# Altium schematic sheet Схема принципиальная.SchDoc
size 209 x 297 mm; Наименование организации: SmartThings; Наименование изделия 1: SmartHeat Electric; Наименование изделия 2: Схема электрическая; Наименование изделия 3: принципиальная
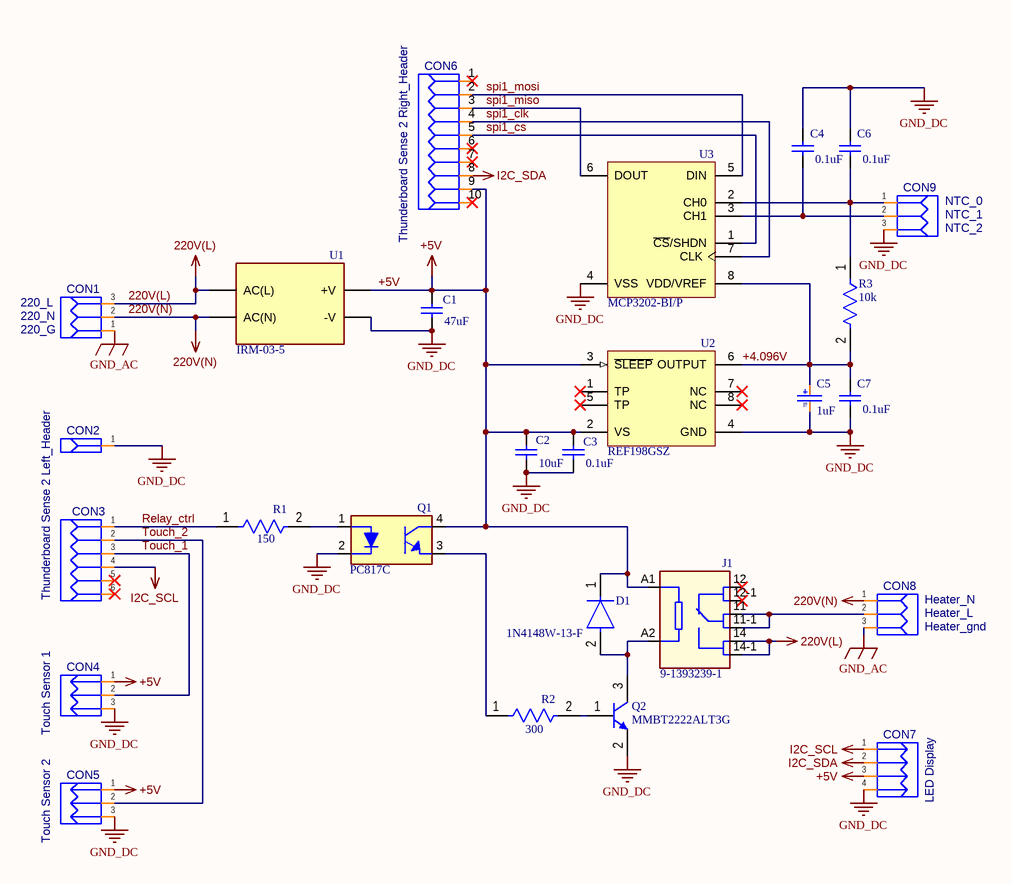
[diagram p0: Схема принципиальная.SchDoc]

## Parts
C1  47uF  [MURA-1210_H_2.7_L]
C2  10uF  [CAPC2013X135X45ML10T25]
C3  0.1uF  [CAPC2013X140X45NL15T25]
C4  0.1uF  [CAPC2013X140X45NL15T25]
C5  1uF  [TANTAL_B]
C6  0.1uF  [CAPC2013X140X45NL15T25]
C7  0.1uF  [CAPC2013X140X45NL15T25]
CON1  DG128-3  [DG129-5.08-3]  (value not drawn)
CON2  PBS-01  [PBS-01]  (value not drawn)
CON3  PBS-06  [PBS-06]  (value not drawn)
CON4  PLS-03  [PLS-03]  (value not drawn)
CON5  PLS-03  [PLS-03]  (value not drawn)
CON6  PBS-10  [PBS-10]  (value not drawn)
CON7  PLS-04  [PLS-04]  (value not drawn)
CON8  DG128-3  [DG129-5.08-3]  (value not drawn)
CON9  DG128-3  [DG129-5.08-3]  (value not drawn)
D1  1N4148W-13-F  [FP-SOD123-MFG]
J1  9-1393239-1  [RELAY_9-1393239-1]
Q1  PC817C  [DIP762W50P254L650H458Q4B]
Q2  MMBT2222ALT3G  [ONSC-SOT-23-3-318-08_V]
R1  150  [FP-CR0805-IPC_C]
R2  300  [FP-CR0805-IPC_C]
R3  10k  [FP-CRCW1206-e3-IPC_C]
U1  IRM-03-5  [footprint_IRM-03-5]
U2  REF198GSZ  [ADI-R-8_M]
U3  MCP3202-BI/P  [PDIP300-P8]

## Nets
220V(L): CON1.3 J1.14 J1.14-1 U1.AC/L(AC(L))
220V(N): CON1.2 CON8.1 U1.AC/N(AC(N))
+5V: C1.2 C2.2 C3.2 CON4.1 CON5.1 CON6.9 CON7.3 D1.1(C) J1.A1 Q1.4 U1.+V U2.2(VS) U2.3(~{SLEEP})
GND_AC: CON1.1 CON8.3
GND_DC: C1.1 C2.1 C3.1 C4.2 C5.2 C6.2 C7.1 CON2.1 CON4.3 CON5.3 CON7.4 CON9.3 Q1.2 Q2.2(E) U1.-V U2.4(GND) U3.4(VSS)
I2C_SCL: CON3.4 CON7.1
I2C_SDA: CON6.8 CON7.2
+4.096V: C5.1 C7.2 R3.2 U2.6(OUTPUT) U3.8(VDD/VREF)
Relay_ctrl: CON3.1 R1.1
spi1_clk: CON6.4 U3.7(CLK)
spi1_cs: CON6.5 U3.1(~{CS}/SHDN)
spi1_miso: CON6.3 U3.6(DOUT)
spi1_mosi: CON6.2 U3.5(DIN)
Touch_1: CON3.3 CON4.2
Touch_2: CON3.2 CON5.2
NetC4_1: C4.1 CON9.2 U3.3(CH1)
NetC6_1: C6.1 CON9.1 R3.1 U3.2(CH0)
NetCON8_2: CON8.2 J1.11 J1.11-1
NetD1_2: D1.2(A) J1.A2 Q2.3(C)
NetQ1_1: Q1.1 R1.2
NetQ1_3: Q1.3 R2.1
NetQ2_1: Q2.1(B) R2.2

Not connected (* = marked no-connect by the designer): CON3 5* 6*; CON6 1* 6* 7* 10*; J1 12* 12-1(12)*; U2 1(TP)* 5(TP)* 7(NC)* 8(NC)*

## Notes on the sheet
- (near CON9) NTC_0
- Thunderboard Sense 2 Right_Header
- (near CON9) NTC_1
- (near CON9) NTC_2
- (near CON1) 220_L
- (near CON1) 220_N
- (near CON1) 220_G
- Thunderboard Sense 2 Left_Header
- (near CON8) Heater_N
- (near CON8) Heater_L
- (near CON8) Heater_gnd
- Touch Sensor 1
- (near CON7) LED Display
- Touch Sensor 2
- Перв. примен.
- Справ. №
- Подп. и дата
- Инв. № дубл.
- Взам. инв. №
- Разраб.
- Изм.
- Лист
- № докум.
- Подп.
- Дата
- Лит.
- Масса
- Масштаб
- Пров.
- Т.контр.
- Листов
- Инв. № подл.
- Утв.
- Н.контр.
- Копировал
- Формат А4
- (in symbol _TANTAL-B) TB

## Library data of the parts
C1 = CMP-2000-06362-1: Cap Ceramic, 47 uF, +/- 10%, -55 to 85 degC, 2-Pin SMD (1210), RoHS, Tape and Reel; Manufacturer: Murata; Catalog Drawings: GRMSeries_1210_2.5; Voltage Rating DC: 16V; Capacitance: 47µF; Product Training Modules: High-CapMultilayerCeramicCapacitors; Temperature Coefficient: X5R; Online Catalog: GRMSeries; Other Names: 490-6539-6; Lead Style: -; Datasheet URL: http://psearch.en.murata.com/capacitor/product/GRM32ER61C476KE15%23.pdf; Package Description: 2-Pin Surface Mount Device, Body 3.2 x 2.5 mm; Applications: GeneralPurpose; Thickness (Max): 0.106"(2.70mm); Operating Temperature: -55°C~85°C; Mounting Technology: SurfaceMount; Category: Capacitors; Package / Case: 1210(3225Metric); Mounting Type: SurfaceMount,MLCC; Ratings: -; Package Reference: 1210; Height - Seated (Max): -; Series: GRM; Lead Spacing: -; Family: CeramicCapacitors; Datasheet Version: 04/2016; Tolerance: ±10%; Size / Dimension: 0.126"Lx0.098"W(3.20mmx2.50mm); Packaging: Digi-Reel®; Voltage - Rated: 16V; Standard Package: 1; Features: -; Manufacturer URL: http://www.murata.com/
C2 = CMP-2000-04946-1: GRM21BR61E106KA73L / 10uF, +/- 10%, 25 V, 0805; Manufacturer: Murata; Dielectric: X7R; Capacitance: 1µF; Rated Voltage: 16V; Package Description: 2-Pin Surface Mount Device, Body 2 x 1.25 mm; Datasheet Version: Mar-08; Package Reference: 805; Datasheet URL: https://datasheet.ciiva.com/34302/1858922-34302874.pdf; Case Size/Dimension: 0805; Tolerance (%): ±10%; Manufacturer URL: http://www.murata.com/
C3 C4 C6 C7 = CMP-2007-03401-1: GRM21BR71H104K / 0.1 мкФ X7R 10% 50В 0805; Part Number: GRM21BR71C475KA73L; Manufacturer: Murata
C5 = _TANTAL-B: TANTAL TECAP1/50V B, 10%; Note: Tantalum Capacitors; Lifetime @ Temp: 2000Hrs@105℃; Publisher: Catcatcat Electronics; website developer: http://catcatcat.d-lan.dp.ua/; Assembly type: Manual Part; Value: 1uF
CON1 CON8 CON9 = DG129-5.08-3: Note: Connector; Temp.Characteristic: -40C to +85C; Value: *; Publisher: Catcatcat Electronics; Website developer: http://catcatcat.d-lan.dp.ua/; Assembly type: Manual Part
CON2 = PBS-01: 2.54mm; Note: Connector; Temp.Characteristic: -40C to +85C; Value: *; Publisher: Catcatcat Electronics; Website developer: http://catcatcat.d-lan.dp.ua/; Assembly type: Manual Part
CON3 = PBS-06: 2.54mm; Note: Connector; Temp.Characteristic: -40C to +85C; Value: *; Publisher: Catcatcat Electronics; Website developer: http://catcatcat.d-lan.dp.ua/; Assembly type: Manual Part
CON4 CON5 = PLS-03: 2.54 mm; Note: Connector; Temp.Characteristic: -40C to +85C; Value: *; Publisher: Catcatcat Electronics; Website developer: http://catcatcat.d-lan.dp.ua/; Assembly type: Manual Part
CON6 = PBS-10: 2.54mm; Note: Connector; Temp.Characteristic: -40C to +85C; Value: *; Publisher: Catcatcat Electronics; Website developer: http://catcatcat.d-lan.dp.ua/; Assembly type: Manual Part
CON7 = PLS-04: 2.54 mm; Note: Connector; Temp.Characteristic: -40C to +85C; Value: *; Publisher: Catcatcat Electronics; Website developer: http://catcatcat.d-lan.dp.ua/; Assembly type: Manual Part
D1 = CMP-12791-000005-1: DIODE GEN PURP 100V 150MA SOD123; Manufacturer: Diodes Inc.; Capacitance: 2pF; Forward Current: 300mA; Max Junction Temp: +150°C; Value: 2pF; Standoff Height: 0mm; Peak Reverse Current: 1uA; Max Surge Forward Current: 1A; Category: Diode; Height: 1.45mm; ComponentLink2URL: https://upverter.com/datasheet/628e7d6fee5901eee6eef4567d1c3569f2cd3cde.pdf; Lead Free: Yes; ComponentLink2Description: Datasheet; Octopart: https://octopart.com/1n4148w-13-f-diodes+inc.-2359612; Temperature Range High: +150°C; Device Class L2: Diodes; Digikey Description: DIODE GEN PURP 100V 150MA SOD123; Reverse Voltage: 100V; Temperature Range Low: -65°C; Device Class L1: Discrete Semiconductors; Package: SOD123; RoHS: TRUE; Manufacturer Part Number: 1N4148W-13-F; Footprint Url: https://www.diodes.com/assets/Package-Files/SOD123.pdf; Automotive: No; Max Repetitive Reverse Voltage: 100V; Mouser Description: 1N4148W Series 2 A 100 V 400 mW Surface Mount Fast Switching Diode - SOD-123; Temperature: -65°C to +150°C; Device Class L3: Rectifier Diodes
J1 = 9-1393239-1: RELAY GEN PURPOSE SPDT 16A 5V; MF: {'manufacturer': u'TE Connectivity'}; Package: None; Value: *; Price: None; Availability: Unavailable; MP: 9-1393239-1
Q1 = PC817C: High Density Mounting Type Photocoupler; MF: {'manufacturer': u'Taiwan Semiconductor'}; Package: None; MP: PC817C; Value: *; Price: None; Availability: Unavailable
Q2 = CMP-1048-00592-1: General Purpose Transistor, NPN Silicon, 3-Pin SOT-23, Pb-Free, Tape and Reel; Manufacturer: On Semiconductor; fT Min (MHz): 300; IC Continuous (A): 0.6; PackageReference: SOT-23-3-318-08; ComponentLink3URL: http://www.onsemi.cn/pub_link/Collateral/318-08.PDF; DatasheetVersion: Rev. 10; Packing: Tape and Reel; Mounting Technology: Surface Mount; ComponentLink2Description: Datasheet; ComponentLink1URL: http://www.onsemi.com/; ComponentLink2URL: http://www.onsemi.cn/pub_link/Collateral/MMBT2222LT1-D.PDF; PackageVersion: Rev. AP, 11/2009; PartNumber: MMBT2222ALT3G; RoHS: TRUE; PackageDescription: 3-Pin Small Outline Transistor, Body 2.92 x 1.3 mm, Pitch 0.95 mm; ComponentLink3Description: Package Specification; Polarity: NPN; ComponentLink1Description: Manufacturer URL
R1 = CMP-07231-005922-1: 0805 150Ω 0.125W 1%; Power Rating: 125mW; Voltage Rating: 150V; Temperature Coefficient: 100ppm/°C; Resistance: 300kR; Max Power Dissipation: 125mW; Tolerance: 1%; Radiation Hardening: No; Max Operating Temperature: 155°C; Contact Plating: Tin; Length: 2mm; Military Standard: Not; Depth: 1.25mm; Min Operating Temperature: -55°C; Package Quantity: 1; Number of Terminations: 2; Composition: Thick Film; Packaging: Tape and Reel; Mount: Surface Mount; Case/Package: 0805; Thickness: 508um; Case Code (Imperial): 0805; Features: Moisture Resistant; Case Code (Metric): 2012; Width: 0.049inch; Height: 0.024inch; Termination: SMD/SMT
R2 = CMP-07231-005922-1: 0805 300kΩ 0.125W 1%; Power Rating: 125mW; Voltage Rating: 150V; Temperature Coefficient: 100ppm/°C; Resistance: 300kR; Max Power Dissipation: 125mW; Tolerance: 1%; Radiation Hardening: No; Max Operating Temperature: 155°C; Contact Plating: Tin; Length: 2mm; Military Standard: Not; Depth: 1.25mm; Min Operating Temperature: -55°C; Package Quantity: 1; Number of Terminations: 2; Composition: Thick Film; Packaging: Tape and Reel; Mount: Surface Mount; Case/Package: 0805; Thickness: 508um; Case Code (Imperial): 0805; Features: Moisture Resistant; Case Code (Metric): 2012; Width: 0.049inch; Height: 0.024inch; Termination: SMD/SMT
R3 = CMP-2003-04807-2: 10kΩ, 1%, 0.25W 1206; Working Voltage: 200V; Max Power Dissipation: 250mW; Resistance: 10kR; Temperature Coefficient: 100ppm/°C; Tolerance: 1%; Width: 0.063inch; Height: 0.55mm; Number of Pins: 2; Voltage Rating: 200V; Military Standard: Not; Features: Automotive AEC-Q200; Depth: 1.6mm; Radiation Hardening: No; Termination: SMD/SMT; Case Code (Imperial): 1206; Weight: 0.000353oz; Length: 3.2mm; Package Quantity: 10; Voltage Rating (DC): 200V; Case/Package: 1206; Min Operating Temperature: -55°C; Number of Terminations: 2; Composition: Thick Film; Contact Plating: Tin; Power Rating: 250mW; Packaging: Tape and Reel; Max Operating Temperature: 155°C; Lead Free: Lead Free; Case Code (Metric): 3216
U1 = IRM-03-5: AC-DC Single output Encapsulated power supply; Output 5Vdc at 0.6A; PCB mount, miniature size; MF: {'manufacturer': u'MEAN WELL'}; Package: None; MP: IRM-03-5; Price: None; Value: *; Availability: Unavailable
U2 = CMP-0784-00265-1: Precision Micropower, Low Dropout Voltage Reference, 4.096 V Output, 3.4 to 15 V Supply, Industrial, 8-pin SOIC (R-8), Tube; Manufacturer: Analog Devices; Ref Out TC (ppm/C): 10; Vout: 4.096V; PackageVersion: 060506-A, 06/2006; Operating Temp Range: -40 to 85 degC; ComponentLink3URL: http://www.analog.com/static/imported-files/packages/PKG_PDF/SOIC_Narrow%20(R)/R_8.pdf; ComponentLink2Description: Datasheet; PartNumber: REF198GSZ; ComponentLink4Description: URL Link1; ComponentLink4URL: Product URL:http://www.analog.com/en/special-linear-functions/voltage-references/ref198/products/product.html; ComponentLink2URL: http://www.analog.com/static/imported-files/data_sheets/REF19xSeries.pdf; PackageDescription: 8-Pin Standard Small Outline Package, Body 4.9 x 3.9 mm, Pitch 1.27 mm; ComponentLink1Description: Manufacturer URL; ComponentLink3Description: Package Specification; ComponentLink1URL: http://www.analog.com/en/index.html; PackageReference: R-8; Mounting Technology: Surface Mount; Packing: Tube; DatasheetVersion: Rev. L; Code_JEDEC: MS-012-AA
U3 = CMP-0188-00011-2: 2.7V Dual Channel 12-Bit A/D Converter with SPI Serial Interface, 8-Pin PDIP, B Performance Grade, Industrial Temperature; DatasheetVersion: revF, Nov-2011; ComponentLink2Description: Datasheet; ComponentLink1Description: Manufacturer URL; PackageVersion: revBB, Aug-2009; RevisionNote: URLs added. DatasheetVersion updated.; PackageDescription: 8-Lead Plastic Dual In-Line (P) - 300 mil Body [PDIP]; ComponentLink3URL: http://www.microchip.com/stellent/groups/techpub_sg/documents/packagingspec/en012702.pdf; ComponentLink3Description: Package Specification; Code_JEDEC: MS-001; ComponentLink2URL: http://ww1.microchip.com/downloads/en/DeviceDoc/21034F.pdf; ComponentLink1URL: http://www.microchip.com/; PackageReference: PDIP300-P8